# EAGLE design rpi2dmd-pi1B-v2 (EAGLE 7.4.0)
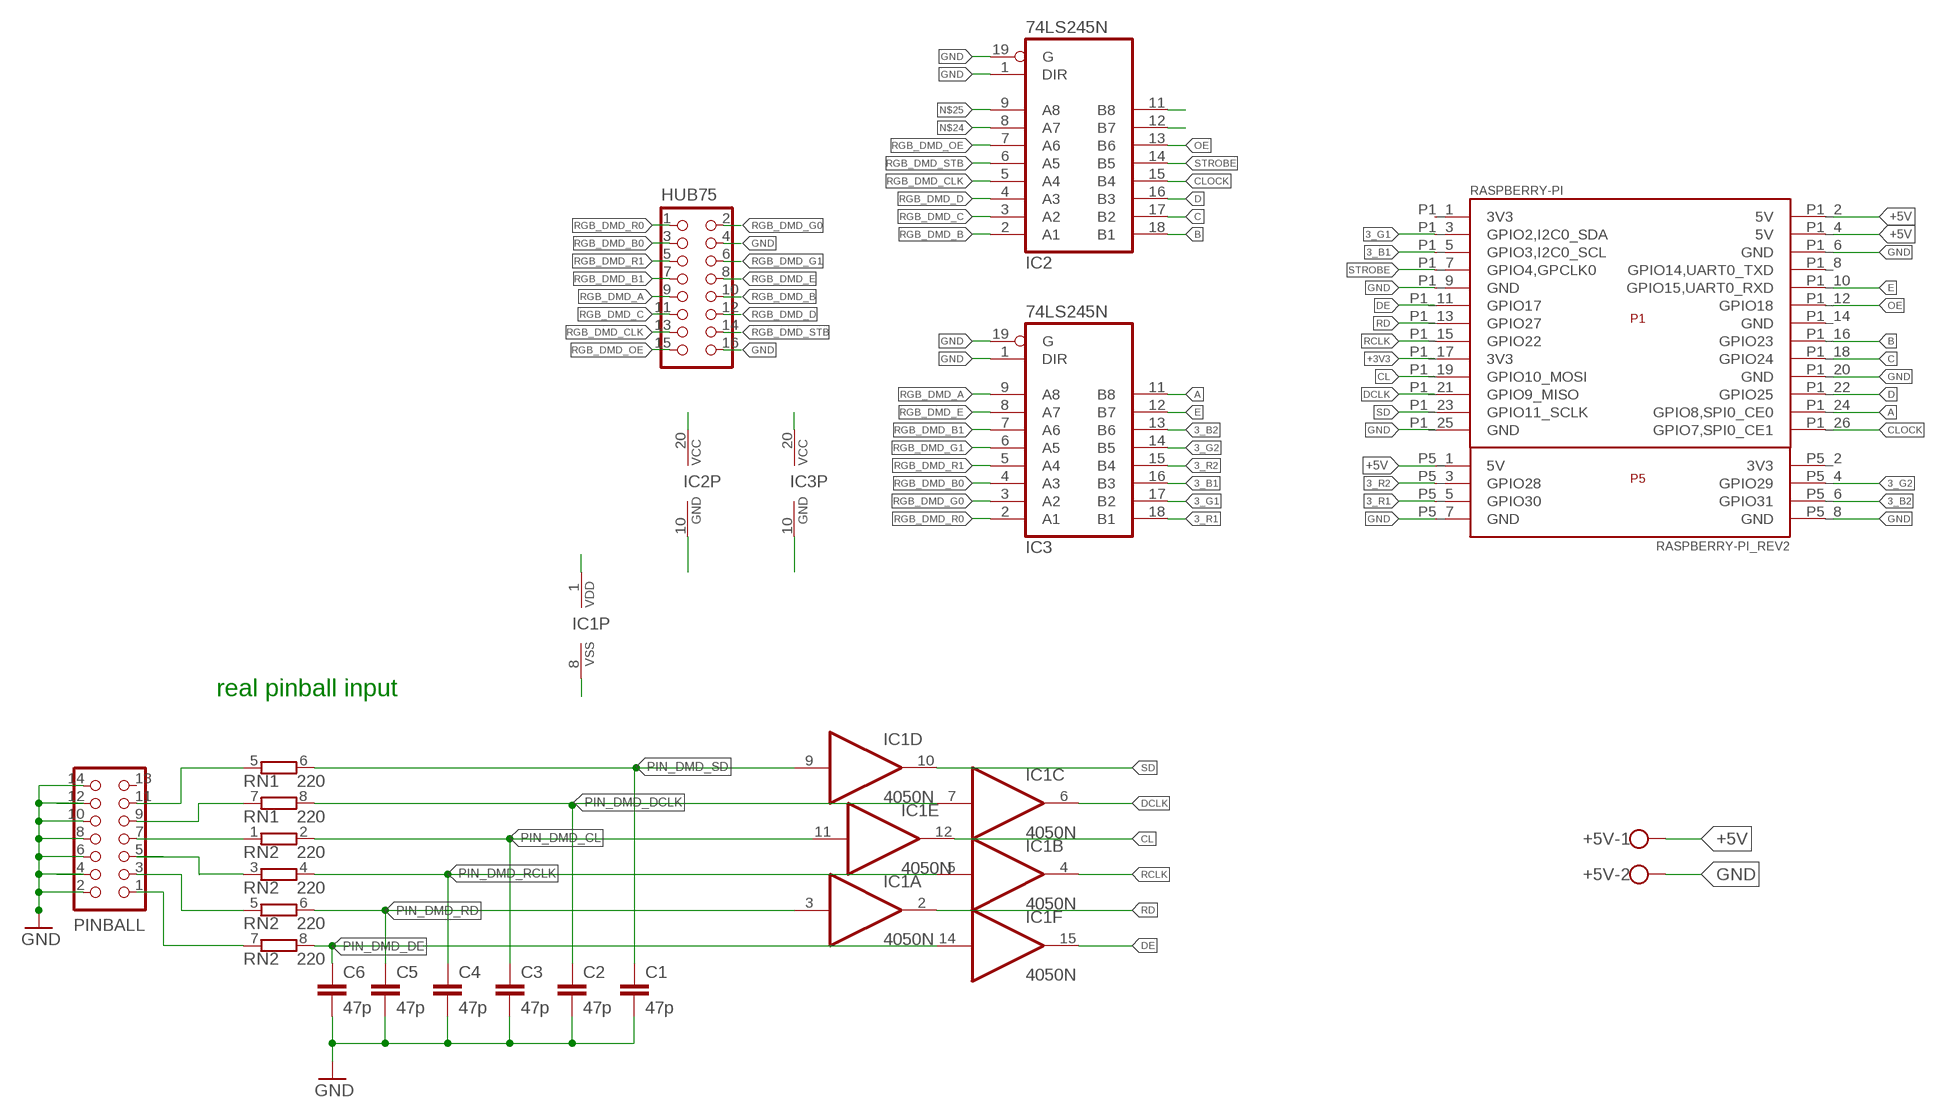
[diagram p0: schematic, sheet 1]

## Parts
+5V  W237-102  [W237-102]
C1  47p  C-EU025-024X044  [C025-024X044]
C2  47p  C-EU025-024X044  [C025-024X044]
C3  47p  C-EU025-024X044  [C025-024X044]
C4  47p  C-EU025-024X044  [C025-024X044]
C5  47p  C-EU025-024X044  [C025-024X044]
C6  47p  C-EU025-024X044  [C025-024X044]
HUB75  CON_HEADER_2X08B  [PINSHRD_PTH_2X08]
IC1  4050N  [DIL16]
IC2  74LS245N  [DIL20]
IC3  74LS245N  [DIL20]
PINBALL  CON_HEADER_2X07-PTH-SHROUDED  [PINSHRD_PTH_2X07]
RASPBERRY-PI  RASPBERRY-PI_REV2  [RASPBERRY-PI_REV2]
RN1  220  E4RP  [SIL8]
RN2  220  E4RP  [SIL8]

## Nets
3_B1: IC3.16(B3) RASPBERRY-PI.P1_5(GPIO3,I2C0_SCL)
3_B2: IC3.13(B6) RASPBERRY-PI.P5_6(GPIO31)
3_G1: IC3.17(B2) RASPBERRY-PI.P1_3(GPIO2,I2C0_SDA)
3_G2: IC3.14(B5) RASPBERRY-PI.P5_4(GPIO29)
3_R1: IC3.18(B1) RASPBERRY-PI.P5_5(GPIO30)
3_R2: IC3.15(B4) RASPBERRY-PI.P5_3(GPIO28)
+3V3: IC1.1(P:VDD) RASPBERRY-PI.P1_17(3V3)
+5V: +5V.1 IC2.20(VCC) IC3.20(VCC) RASPBERRY-PI.P1_2(5V) RASPBERRY-PI.P1_4(5V) RASPBERRY-PI.P5_1(5V)
A: IC3.11(B8) RASPBERRY-PI.P1_24(GPIO8,SPI0_CE0)
B: IC2.18(B1) RASPBERRY-PI.P1_16(GPIO23)
C: IC2.17(B2) RASPBERRY-PI.P1_18(GPIO24)
CL: IC1.12(E:O) RASPBERRY-PI.P1_19(GPIO10_MOSI)
CLOCK: IC2.15(B4) RASPBERRY-PI.P1_26(GPIO7,SPI0_CE1)
D: IC2.16(B3) RASPBERRY-PI.P1_22(GPIO25)
DCLK: IC1.6(C:O) RASPBERRY-PI.P1_21(GPIO9_MISO)
DE: IC1.15(F:O) RASPBERRY-PI.P1_11(GPIO17)
E: IC3.12(B7) RASPBERRY-PI.P1_10(GPIO15,UART0_RXD)
GND: +5V.2 C1.2 C2.2 C3.2 C4.2 C5.2 C6.2 HUB75.4 HUB75.16 IC1.8(P:VSS) IC2.1(DIR) IC2.10(GND) IC2.19(G) IC3.1(DIR) IC3.10(GND) IC3.19(G) PINBALL.2 PINBALL.4 PINBALL.6 PINBALL.8 PINBALL.10 PINBALL.12 PINBALL.14 RASPBERRY-PI.P1_6(GND) RASPBERRY-PI.P1_9(GND) RASPBERRY-PI.P1_20(GND) RASPBERRY-PI.P1_25(GND) RASPBERRY-PI.P5_7(GND) RASPBERRY-PI.P5_8(GND)
N$5: PINBALL.7 RN2.1
N$6: PINBALL.5 RN2.3
N$7: IC2.12(B7)
N$8: IC2.11(B8)
N$11: PINBALL.3 RN2.5
N$12: PINBALL.1 RN2.7
N$13: PINBALL.9 RN1.7
N$14: PINBALL.11 RN1.5
N$24: IC2.8(A7)
N$25: IC2.9(A8)
OE: IC2.13(B6) RASPBERRY-PI.P1_12(GPIO18)
PIN_DMD_CL: C3.1 IC1.11(E:I) RN2.2
PIN_DMD_DCLK: C2.1 IC1.7(C:I) RN1.8
PIN_DMD_DE: C6.1 IC1.14(F:I) RN2.8
PIN_DMD_RCLK: C4.1 IC1.5(B:I) RN2.4
PIN_DMD_RD: C5.1 IC1.3(A:I) RN2.6
PIN_DMD_SD: C1.1 IC1.9(D:I) RN1.6
RCLK: IC1.4(B:O) RASPBERRY-PI.P1_15(GPIO22)
RD: IC1.2(A:O) RASPBERRY-PI.P1_13(GPIO27)
RGB_DMD_A: HUB75.9 IC3.9(A8)
RGB_DMD_B: HUB75.10 IC2.2(A1)
RGB_DMD_B0: HUB75.3 IC3.4(A3)
RGB_DMD_B1: HUB75.7 IC3.7(A6)
RGB_DMD_C: HUB75.11 IC2.3(A2)
RGB_DMD_CLK: HUB75.13 IC2.5(A4)
RGB_DMD_D: HUB75.12 IC2.4(A3)
RGB_DMD_E: HUB75.8 IC3.8(A7)
RGB_DMD_G0: HUB75.2 IC3.3(A2)
RGB_DMD_G1: HUB75.6 IC3.6(A5)
RGB_DMD_OE: HUB75.15 IC2.7(A6)
RGB_DMD_R0: HUB75.1 IC3.2(A1)
RGB_DMD_R1: HUB75.5 IC3.5(A4)
RGB_DMD_STB: HUB75.14 IC2.6(A5)
SD: IC1.10(D:O) RASPBERRY-PI.P1_23(GPIO11_SCLK)
STROBE: IC2.14(B5) RASPBERRY-PI.P1_7(GPIO4,GPCLK0)
Unconnected: PINBALL.13 RASPBERRY-PI.P1_1(3V3) RASPBERRY-PI.P1_8(GPIO14,UART0_TXD) RASPBERRY-PI.P1_14(GND) RASPBERRY-PI.P5_2(3V3) RN1.1 RN1.2 RN1.3 RN1.4

## Notes on the sheet
- real pinball input

## Library data of the parts
+5V = con-wago-500:W237-102: WAGO SCREW CLAMP; MPN: 237-102; OC_FARNELL: unknown; OC_NEWARK: 70K9898
C1-C6 = resistor:C-EU: CAPACITOR, European symbol
HUB75 = dp_devices.v6:CON_HEADER_2X08
IC1 = 40xx:4050: Hex non-inverting BUFFER
IC2 IC3 = 74xx-eu:74*245: Octal BUS TRANSCEIVER, 3-state
PINBALL = dp_devices.v6:CON_HEADER_2X07: 2x07 pin header
RASPBERRY-PI = RaspberryPi:RASPBERRY-PI_REV2: Raspberry Pi Board <http://www.raspberrypi.org/> Jacques Lagnel V1.0 (beta) 2012 Mateusz Bawaj V1.1 (beta) 2012 Board dimension: Forum 3D model <http://www.raspberrypi.org/forum/general-discussion/mechanical-profile-3d-models?value=3d%20model&type=1&include=1&search=1&ret=all> The GPIO Connector (P1): http://elinux.org/RPi_Low-level_peripherals The GPIO Connector (P5): http://www.raspberrypi-spy.co.uk/2012/09/raspberry-pi-p5-header/
RN1 RN2 = resistor-sil:E4RP: SIL RESISTOR; OC_FARNELL: unknown; OC_NEWARK: unknown

## Board
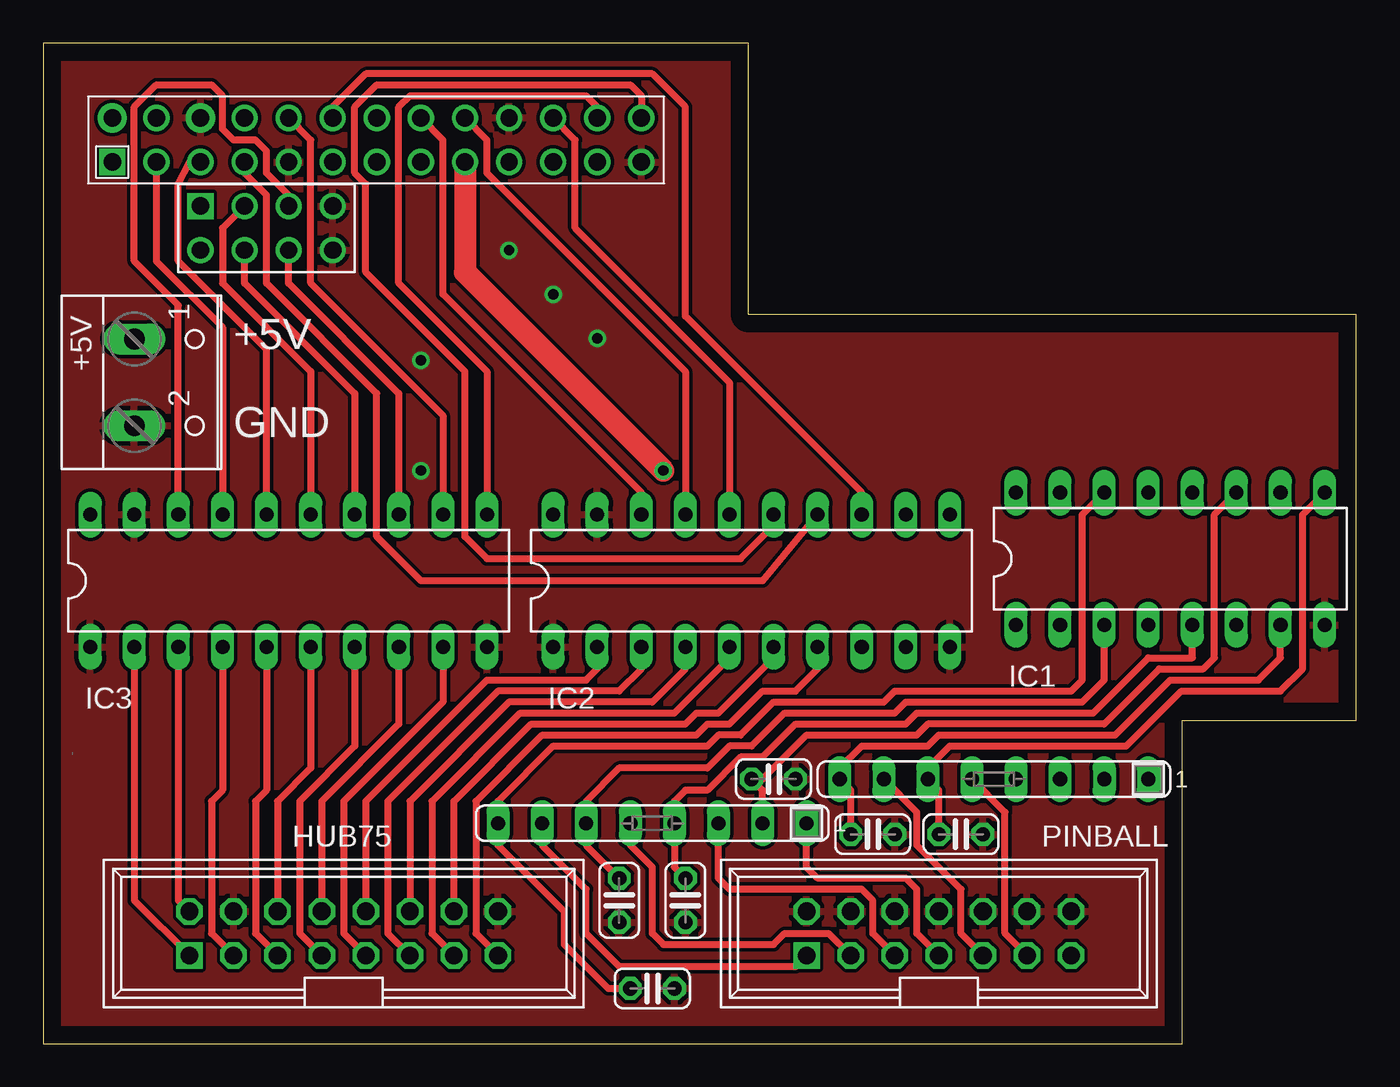
[diagram p1: board, top side]
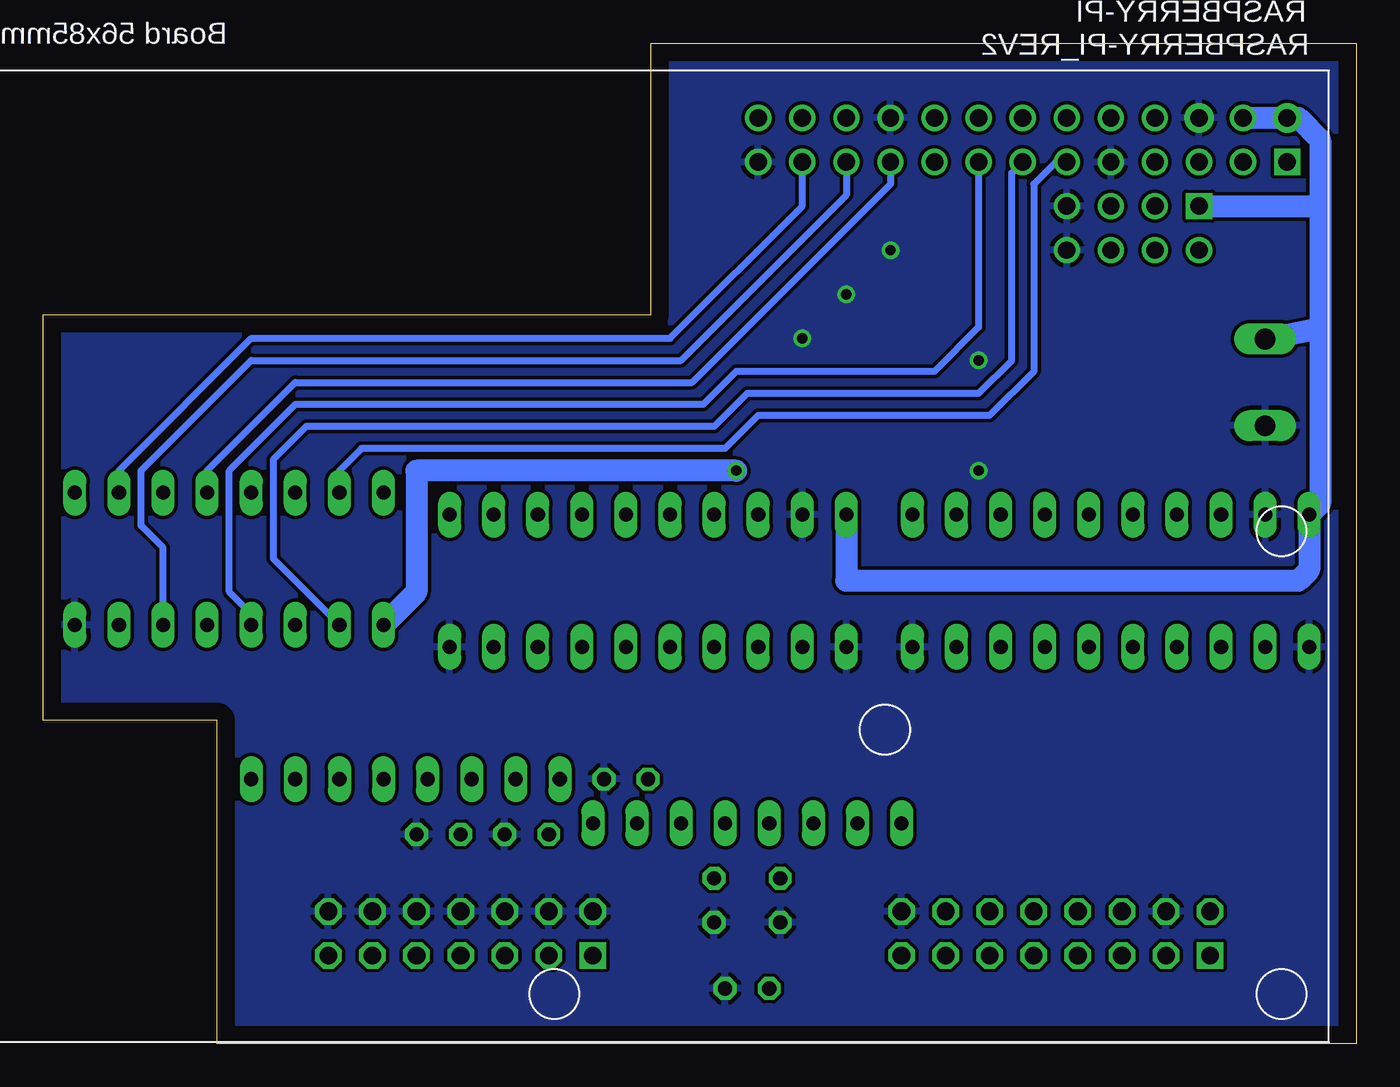
[diagram p2: board, bottom side, seen from below]

Size 75.64 x 57.63 mm. Coordinates in mm from the lower left corner, seen from the top.
Outline: 0,0 65.64,0 65.64,18.64 75.64,18.64 75.64,42 40.64,42 40.64,57.63 0,57.63 0,0
Copper layers (1*16): Top 0.035mm / dielectric 1.5mm / Bottom 0.035mm
Design rules "default *": minimum track width 6mil, minimum drill 12mil, track to track 8mil, track to pad 8mil, pad to pad 8mil, via to via 8mil, smd to smd 8mil, copper to edge 40mil, drill to drill 8mil, minimum pad ring 10mil, minimum via ring 8mil, stop-mask expansion 4mil, vias tented up to drill 0mil, thermal gap 10mil

### Footprints (pad centres in the part's own frame; a part is rotated, then mirrored left to right if it is on the bottom)
W237-102 = drill 1.194 long: 1 -2.5,-1.27; 2 2.5,-1.27
C025-024X044 = drill 0.813 octagon: 1 -1.27,0; 2 1.27,0
PINSHRD_PTH_2X08 = drill 1.016 square: 1 -7.62,-1.27 | drill 1.016 octagon: 2 -7.62,1.27; 3 -5.08,-1.27; 4 -5.08,1.27; 5 -2.54,-1.27; 6 -2.54,1.27; 7 0,-1.27; 8 0,1.27; 9 2.54,-1.27; 10 2.54,1.27; 11 5.08,-1.27; 12 5.08,1.27; 13 7.62,-1.27; 14 7.62,1.27; 15 10.16,-1.27; 16 10.16,1.27
DIL16 = drill 0.813 long: 1 -8.89,-3.81; 2 -6.35,-3.81; 3 -3.81,-3.81; 4 -1.27,-3.81; 5 1.27,-3.81; 6 3.81,-3.81; 7 6.35,-3.81; 8 8.89,-3.81; 9 8.89,3.81; 10 6.35,3.81; 11 3.81,3.81; 12 1.27,3.81; 13 -1.27,3.81; 14 -3.81,3.81; 15 -6.35,3.81; 16 -8.89,3.81
DIL20 = drill 0.813 long: 1 -11.43,-3.81; 2 -8.89,-3.81; 3 -6.35,-3.81; 4 -3.81,-3.81; 5 -1.27,-3.81; 6 1.27,-3.81; 7 3.81,-3.81; 8 6.35,-3.81; 9 8.89,-3.81; 10 11.43,-3.81; 11 11.43,3.81; 12 8.89,3.81; 13 6.35,3.81; 14 3.81,3.81; 15 1.27,3.81; 16 -1.27,3.81; 17 -3.81,3.81; 18 -6.35,3.81; 19 -8.89,3.81; 20 -11.43,3.81
PINSHRD_PTH_2X07 = drill 1.016 square: 1 -7.62,-1.27 | drill 1.016 octagon: 2 -7.62,1.27; 3 -5.08,-1.27; 4 -5.08,1.27; 5 -2.54,-1.27; 6 -2.54,1.27; 7 0,-1.27; 8 0,1.27; 9 2.54,-1.27; 10 2.54,1.27; 11 5.08,-1.27; 12 5.08,1.27; 13 7.62,-1.27; 14 7.62,1.27
RASPBERRY-PI_REV2 = drill 1 square: P1_1 -41.91,21.59; P5_1 -36.83,19.05 | drill 1 pad 1.676: P1_2 -41.91,24.13; P1_6 -36.83,24.13 | drill 1: P1_3 -39.37,21.59; P1_4 -39.37,24.13; P1_5 -36.83,21.59; P1_7 -34.29,21.59; P1_8 -34.29,24.13; P1_9 -31.75,21.59; P1_10 -31.75,24.13; P1_11 -29.21,21.59; P1_12 -29.21,24.13; P1_13 -26.67,21.59; P1_14 -26.67,24.13; P1_15 -24.13,21.59; P1_16 -24.13,24.13; P1_17 -21.59,21.59; P1_18 -21.59,24.13; P1_19 -19.05,21.59; P1_20 -19.05,24.13; P1_21 -16.51,21.59; P1_22 -16.51,24.13; P1_23 -13.97,21.59; P1_24 -13.97,24.13; P1_25 -11.43,21.59; P1_26 -11.43,24.13; P5_2 -36.83,16.51; P5_3 -34.29,19.05; P5_4 -34.29,16.51; P5_5 -31.75,19.05; P5_6 -31.75,16.51; P5_7 -29.21,19.05; P5_8 -29.21,16.51
SIL8 = drill 0.813 long: 1 -8.89,0; 2 -6.35,0; 3 -3.81,0; 4 -1.27,0; 5 1.27,0; 6 3.81,0; 7 6.35,0; 8 8.89,0

### Placement (x,y rotation side)
+5V  6.51,38.1 270 top
C1  52.87,12.06 0 top
C2  47.79,12.06 0 top
C3  42.07,15.24 0 top
C4  36.99,8.26 270 top
C5  33.18,8.26 270 top
C6  35.09,3.17 0 top
HUB75  16.04,6.35 0 top
IC1  64.93,27.94 0 top
IC2  40.8,26.67 0 top
IC3  14.13,26.67 0 top
PINBALL  51.59,6.35 0 top
RASPBERRY-PI  45.88,29.21 0 top
RN1  54.77,15.24 180 top
RN2  35.09,12.7 180 top

### Tracks (layer width: path | path; a pad name or v marks a point on that pad's centre or on a via)
3_B1
  Top 0.406: IC3.16 12.86,40.01 7.78,45.09 7.78,49.53 8.42,50.8 RASPBERRY-PI.P1_5
3_B2
  Top 0.406: RASPBERRY-PI.P5_6 14.13,43.81 20.48,37.47 IC3.13
3_G1
  Top 0.406: RASPBERRY-PI.P1_3 6.51,45.09 10.32,41.27 IC3.17
3_G2
  Top 0.406: RASPBERRY-PI.P5_4 11.59,43.81 17.94,37.47 IC3.14
3_R1
  Top 0.406: IC3.18 7.78,42.55 5.24,45.09 5.24,53.98 6.51,55.24 9.69,55.24 10.32,54.61 10.32,52.7 10.96,52.07 12.22,52.07 12.86,51.44 12.86,50.16 14.13,48.9 RASPBERRY-PI.P5_5
3_R2
  Top 0.406: RASPBERRY-PI.P5_3 10.32,46.99 10.32,43.81 15.4,38.73 IC3.15
+3V3  (via drill 0.6)
  Top 1.27: RASPBERRY-PI.P1_17 24.29,44.45 v35.72,33.02
  Bottom 1.27: v35.72,33.02 54.14,33.02 54.14,26.04 IC1.1
+5V
  Bottom 1.27: 2.06,48.26 2.06,52.07 3.33,53.34 RASPBERRY-PI.P1_2 RASPBERRY-PI.P1_4 | IC2.20 29.37,26.67 3.33,26.67 2.7,27.3 IC3.20 2.06,31.11 2.06,41.27 | RASPBERRY-PI.P5_1 2.06,48.26 | 2.06,48.26 2.06,41.27 | +5V.1 2.1,41.23 2.06,41.27
A
  Top 0.406: IC3.11 25.56,38.73 20.48,43.81 20.48,53.98 21.12,54.61 31.28,54.61 31.91,53.98 RASPBERRY-PI.P1_24
B
  Top 0.406: RASPBERRY-PI.P1_16 23.02,52.07 23.02,43.18 34.45,31.75 IC2.18
C
  Top 0.406: RASPBERRY-PI.P1_18 25.56,52.07 25.56,50.16 36.99,38.73 IC2.17
CL
  Bottom 0.406: RASPBERRY-PI.P1_19 26.83,49.53 38.26,38.1 61.12,38.1 66.2,33.02 IC1.12
CLOCK
  Top 0.406: IC2.15 42.07,29.84 40.16,27.94 25.56,27.94 24.29,29.21 24.29,38.73 18.58,44.45 18.58,49.53 17.94,50.16 17.94,53.98 19.21,55.24 33.82,55.24 34.45,54.61 RASPBERRY-PI.P1_26
D
  Top 0.406: RASPBERRY-PI.P1_22 30.64,52.07 30.64,46.99 39.53,38.1 IC2.16
DCLK
  Bottom 0.406: RASPBERRY-PI.P1_21 29.37,48.9 38.9,39.37 63.66,39.37 70.01,33.02 70.01,29.84 68.74,28.57 IC1.6
DE
  Bottom 0.406: RASPBERRY-PI.P1_11 17.31,50.8 18.58,49.53 18.58,38.73 21.12,36.2 34.45,36.2 36.36,34.29 57.31,34.29 58.58,33.02 IC1.15
E
  Top 0.406: RASPBERRY-PI.P1_10 15.4,52.07 15.4,43.81 23.02,36.2 IC3.12
GND  (via drill 0.6)
  other vias: 21.75,33.02 29.37,43.18 26.83,45.72 31.91,40.64 21.75,39.37
  pour Bottom: 0.16,57.78 40.8,57.78 40.8,41.91 75.73,41.91 75.73,17.14 65.56,17.14 65.56,0 0.16,0
  pour Top: 0.16,57.78 40.8,57.78 40.8,41.91 75.73,41.91 75.73,17.14 65.56,17.14 65.56,0 0.16,0
N$5
  Top 0.406: RN2.1 43.98,10.16 44.61,9.53 49.69,9.53 50.33,8.89 50.33,6.35 PINBALL.7
N$6
  Top 0.406: RN2.3 38.9,9.53 39.53,8.89 47.15,8.89 47.79,8.26 47.79,6.35 PINBALL.5
N$11
  Top 0.406: RN2.5 33.82,11.43 35.09,10.16 35.09,6.35 35.72,5.71 42.07,5.71 42.7,6.35 45.25,6.35 PINBALL.3
N$12
  Top 0.406: RN2.7 28.74,11.43 31.28,8.89 31.28,6.35 33.18,4.45 43.34,4.45 PINBALL.1
N$13
  Top 0.406: PINBALL.9 52.87,6.35 52.87,8.89 50.33,11.43 50.33,13.34 RN1.7
N$14
  Top 0.406: PINBALL.11 55.41,6.35 55.41,13.34 RN1.5
OE
  Top 0.406: IC2.13 47.15,31.75 36.99,41.91 36.99,53.98 35.09,55.88 18.58,55.88 16.67,53.98 RASPBERRY-PI.P1_12
PIN_DMD_CL
  Top 0.406: IC1.11 67.47,30.48 67.47,22.23 66.84,21.59 64.3,21.59 61.12,18.41 50.96,18.41 50.33,17.78 43.98,17.78 41.44,15.24 C3.1 41.44,14.61 RN2.2
PIN_DMD_DCLK
  Top 0.406: IC1.7 71.28,22.23 70.01,20.95 64.93,20.95 61.76,17.78 51.59,17.78 50.96,17.14 47.15,17.14 45.88,15.88 RN1.8 46.52,14.61 C2.1
PIN_DMD_DE
  Top 0.406: C6.1 32.55,3.17 30.01,5.71 30.01,7.62 26.2,11.43 RN2.8 26.2,13.97 29.37,17.14 38.26,17.14 38.9,17.78 40.16,17.78 42.07,19.68 48.42,19.68 49.05,20.32 59.22,20.32 59.85,20.95 59.85,30.48 IC1.14
PIN_DMD_RCLK
  Top 0.406: C4.1 36.36,10.16 RN2.4 36.36,13.97 36.99,14.61 38.26,14.61 40.16,16.51 41.44,16.51 43.34,18.41 49.69,18.41 50.33,19.05 60.48,19.05 63.66,22.23 66.2,22.23 IC1.5
PIN_DMD_RD
  Top 0.406: C5.1 31.28,11.43 RN2.6 31.28,13.97 33.18,15.88 38.26,15.88 39.53,17.14 40.8,17.14 42.7,19.05 49.05,19.05 49.69,19.68 59.85,19.68 61.12,20.95 IC1.3
PIN_DMD_SD
  Top 0.406: IC1.9 72.55,30.48 72.55,21.59 71.28,20.32 65.56,20.32 62.39,17.14 52.23,17.14 50.96,15.88 RN1.6 51.59,14.61 C1.1
RCLK
  Bottom 0.406: RASPBERRY-PI.P1_15 21.75,41.27 24.29,38.73 35.72,38.73 37.62,36.83 61.12,36.83 64.93,33.02 64.93,26.04 63.66,24.77 IC1.4
RD
  Bottom 0.406: RASPBERRY-PI.P1_13 19.85,50.16 19.85,39.37 21.75,37.47 35.09,37.47 36.99,35.56 60.48,35.56 62.39,33.66 62.39,27.94 IC1.2
RGB_DMD_A
  Top 0.406: IC3.9 23.02,19.68 17.31,13.97 17.31,6.35 HUB75.9
RGB_DMD_B
  Top 0.406: HUB75.10 18.58,13.97 25.56,20.95 31.28,20.95 31.91,21.59 IC2.2
RGB_DMD_B0
  Top 0.406: IC3.4 10.32,14.61 9.69,13.97 9.69,6.35 HUB75.3
RGB_DMD_B1
  Top 0.406: IC3.7 17.94,17.14 14.77,13.97 14.77,6.35 HUB75.7
RGB_DMD_C
  Top 0.406: HUB75.11 19.85,6.35 19.85,13.97 26.2,20.32 33.18,20.32 34.45,21.59 IC2.3 34.45,22.23
RGB_DMD_CLK
  Top 0.406: HUB75.13 22.39,6.35 22.39,13.97 27.47,19.05 36.36,19.05 39.53,22.23 IC2.5
RGB_DMD_D
  Top 0.406: HUB75.12 21.12,13.97 26.83,19.68 35.09,19.68 36.99,21.59 IC2.4 36.99,22.23
RGB_DMD_E
  Top 0.406: IC3.8 20.48,18.41 16.04,13.97 HUB75.8
RGB_DMD_G0
  Top 0.406: IC3.3 7.78,8.26 HUB75.2
RGB_DMD_G1
  Top 0.406: IC3.6 15.4,15.88 13.49,13.97 HUB75.6
RGB_DMD_OE
  Top 0.406: HUB75.15 24.93,6.35 24.93,13.97 28.74,17.78 37.62,17.78 38.26,18.41 39.53,18.41 41.44,20.32 43.34,20.32 44.61,21.59 IC2.7
RGB_DMD_R0
  Top 0.406: IC3.2 5.24,8.26 HUB75.1
RGB_DMD_R1
  Top 0.406: IC3.5 12.86,14.61 12.22,13.97 12.22,6.35 HUB75.5
RGB_DMD_STB
  Top 0.406: HUB75.14 23.66,13.97 28.1,18.41 36.99,18.41 37.62,19.05 38.9,19.05 42.07,22.23 IC2.6
SD
  Bottom 0.406: IC1.10 71.28,33.02 63.66,40.64 39.53,40.64 31.91,48.26 RASPBERRY-PI.P1_23
STROBE
  Top 0.406: IC2.14 41.44,26.67 21.75,26.67 19.21,29.21 19.21,37.47 12.86,43.81 12.86,48.9 11.59,50.16 RASPBERRY-PI.P1_7

### Text on the board
tNames: +5V | GND